# Altium schematic sheet STeaMi-FP12-Capteur_interne.SchDoc
size A3; DocumentNumber: 1; SheetNumber: 13; SheetTotal: 16
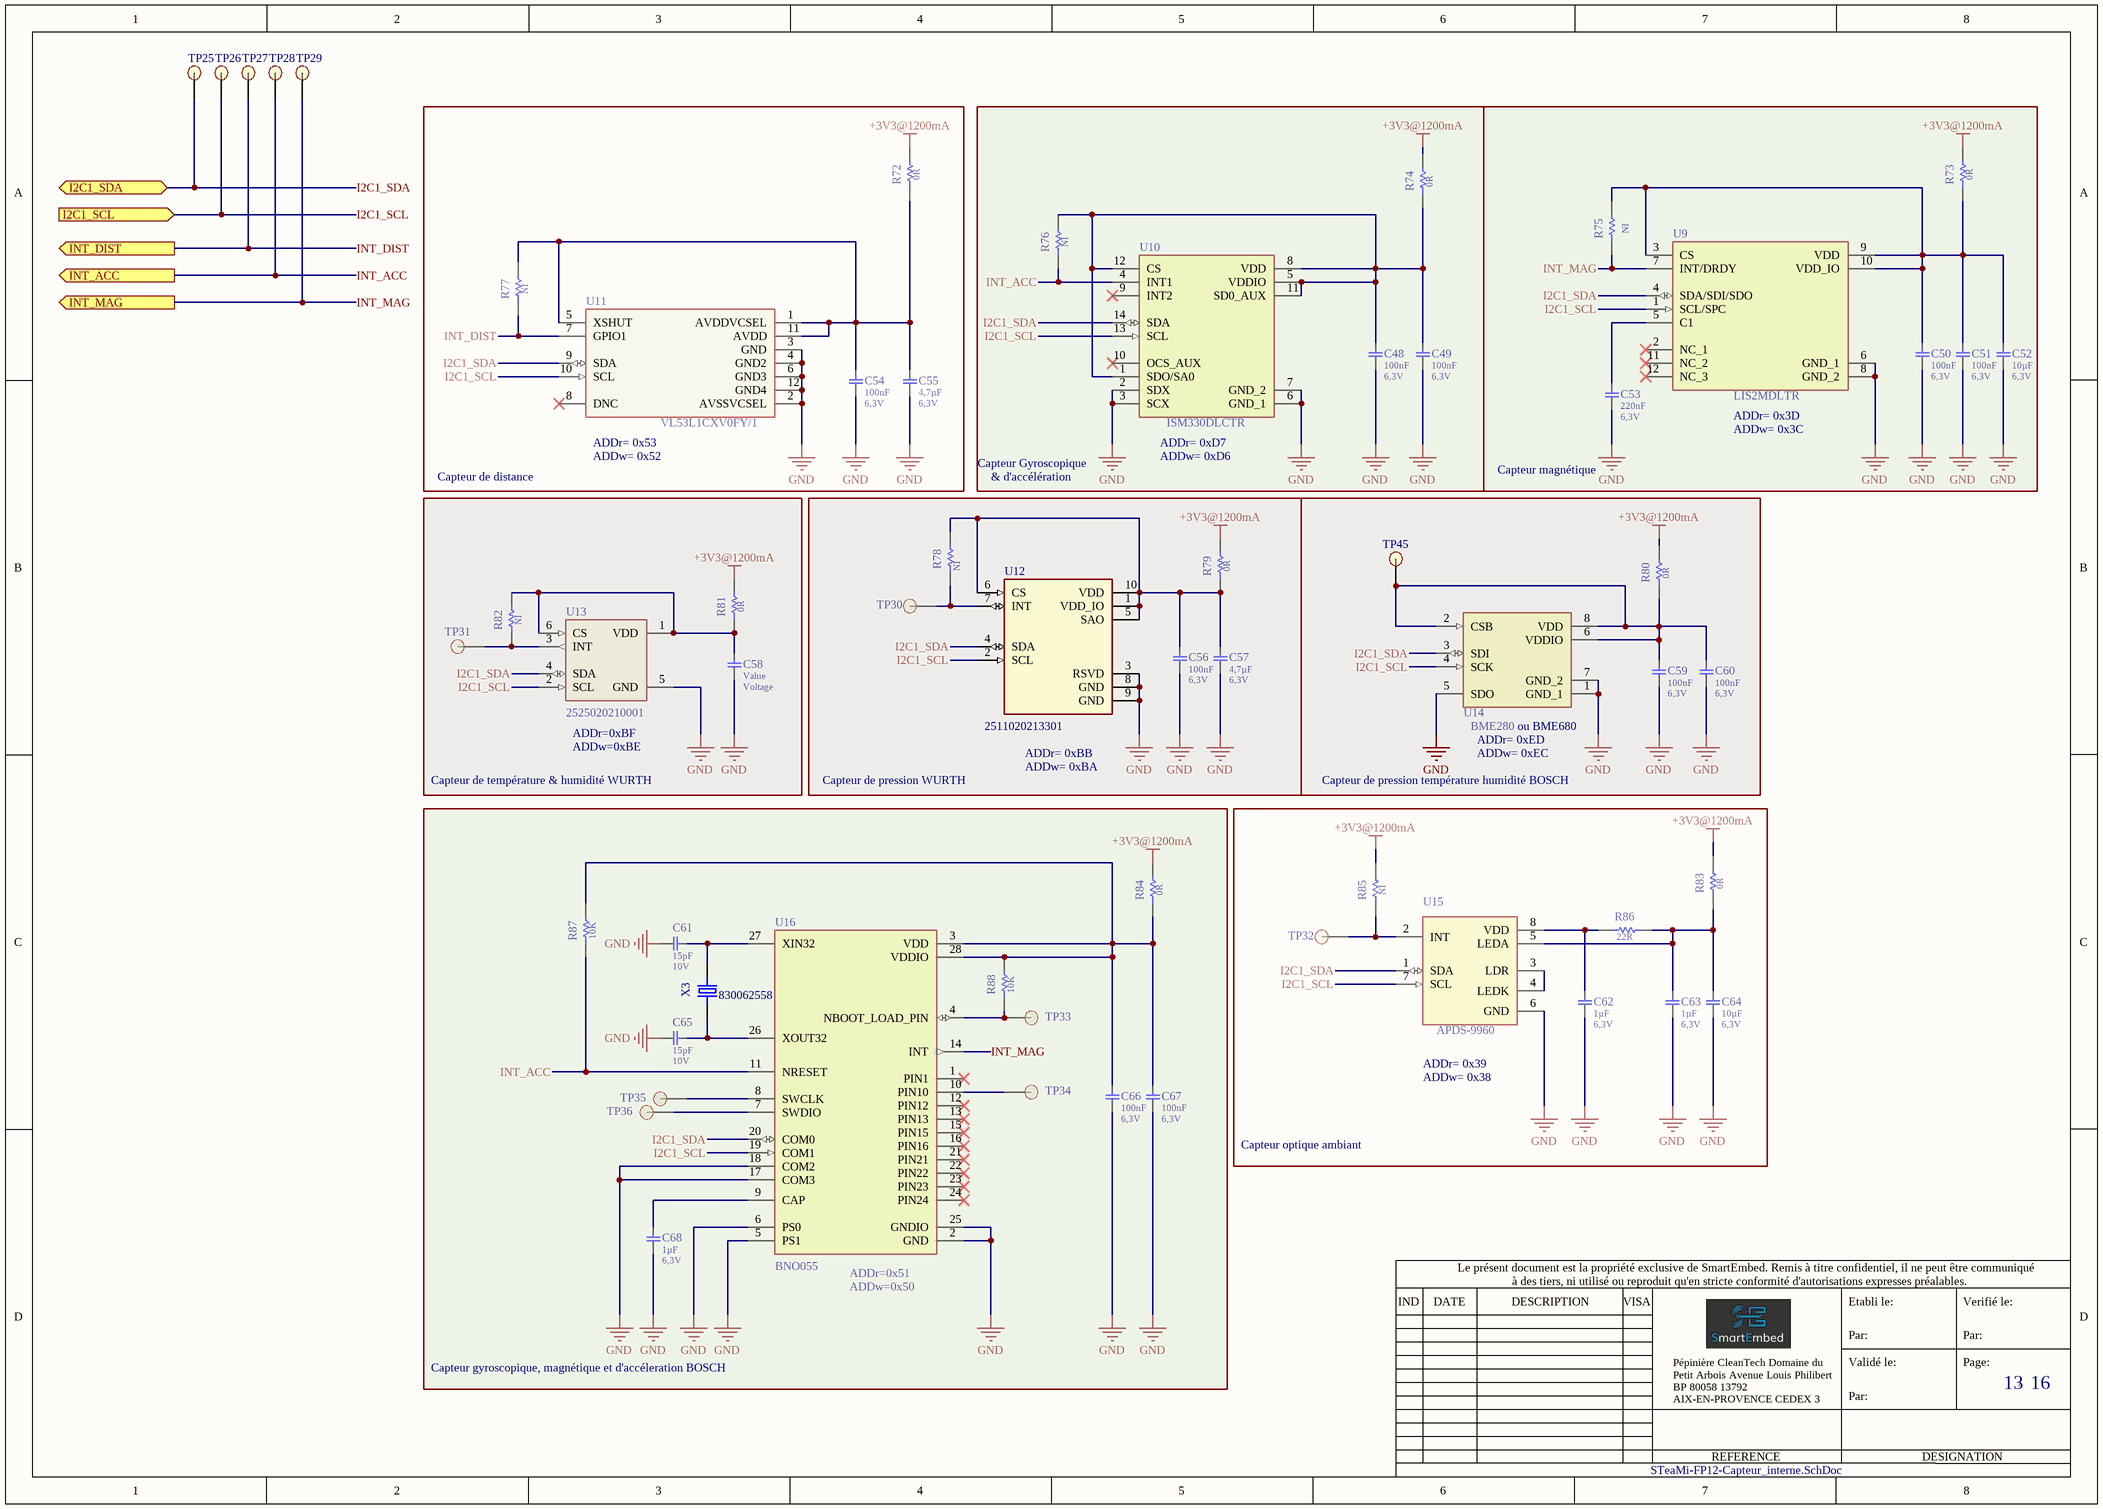
[diagram p0: STeaMi-FP12-Capteur_interne.SchDoc]

## Parts
C48  Capacitance: 100nF  Voltage: 6,3V  [0402-CAP]
C49  Capacitance: 100nF  Voltage: 6,3V  [0402-CAP]
C50  Capacitance: 100nF  Voltage: 6,3V  [0402-CAP]
C51  Capacitance: 100nF  Voltage: 6,3V  [0402-CAP]
C52  Capacitance: 10µF  Voltage: 6,3V  [0402-CAP]
C53  Capacitance: 220nF  Voltage: 6,3V  [0603-CAP-Small]
C54  Capacitance: 100nF  Voltage: 6,3V  [0402-CAP]
C55  Capacitance: 4,7µF  Voltage: 6,3V  [0402-CAP]
C56  Capacitance: 100nF  Voltage: 6,3V  [0402-CAP]
C57  Capacitance: 4,7µF  Voltage: 6,3V  [0402-CAP]
C58  Capacitance: Value  [0402-CAP]
C59  Capacitance: 100nF  Voltage: 6,3V  [0402-CAP]
C60  Capacitance: 100nF  Voltage: 6,3V  [0402-CAP]
C61  Capacitance: 15pF  Voltage: 10V  [0402-CAP]
C62  Capacitance: 1µF  Voltage: 6,3V  [0402-CAP]
C63  Capacitance: 1µF  Voltage: 6,3V  [0402-CAP]
C64  Capacitance: 10µF  Voltage: 6,3V  [0402-CAP]
C65  Capacitance: 15pF  Voltage: 10V  [0402-CAP]
C66  Capacitance: 100nF  Voltage: 6,3V  [0402-CAP]
C67  Capacitance: 100nF  Voltage: 6,3V  [0402-CAP]
C68  Capacitance: 1µF  Voltage: 6,3V  [0402-CAP]
R72  Resistance: 0R  [RESC1005X40N_0402]
R73  Resistance: 0R  [RESC1005X40N_0402]
R74  Resistance: 0R  [RESC1005X40N_0402]
R75  (no value)  [RESC1005X40N_0402]
R76  (no value)  [RESC1005X40N_0402]
R77  (no value)  [RESC1005X40N_0402]
R78  (no value)  [RESC1005X40N_0402]
R79  Resistance: 0R  [RESC1005X40N_0402]
R80  Resistance: 0R  [RESC1005X40N_0402]
R81  Resistance: 0R  [RESC1608X45N_0603]
R82  (no value)  [RESC1608X45N_0603]
R83  Resistance: 0R  [RESC1005X40N_0402]
R84  Resistance: 0R  [RESC1005X40N_0402]
R85  (no value)  [RESC1005X40N_0402]
R86  Resistance: 22R  [RESC1005X40N_0402]
R87  Resistance: 10K  [RESC1005X40N_0402]
R88  Resistance: 10K  [RESC1005X40N_0402]
TP25  SDA1  [Testpoint 1mm]  (value not drawn)  (no BOM)
TP26  SCL1  [Testpoint 1mm]  (value not drawn)  (no BOM)
TP27  INTD  [Testpoint 1mm]  (value not drawn)  (no BOM)
TP28  INTA  [Testpoint 1mm]  (value not drawn)  (no BOM)
TP29  INTM  [Testpoint 1mm]  (value not drawn)  (no BOM)
TP30  PAD  [Testpoint 1mm]  (value not drawn)  (no BOM)
TP31  PAD  [Testpoint 1mm]  (value not drawn)  (no BOM)
TP32  PAD  [Testpoint 1mm]  (value not drawn)  (no BOM)
TP33  PAD  [Testpoint 1mm]  (value not drawn)  (no BOM)
TP34  PAD  [Testpoint 1mm]  (value not drawn)  (no BOM)
TP35  PAD  [Testpoint 1mm]  (value not drawn)  (no BOM)
TP36  PAD  [Testpoint 1mm]  (value not drawn)  (no BOM)
TP45  PAD  [Testpoint 1mm]  (value not drawn)  (no BOM)
U9  (no value)  [LGA-12-2x2MM]
U10  (no value)  [LGA-14-2.5X3MM]
U11  Manufacturer Part Number: VL53L1CXV0FY/1  [VL53L1X]
U12  (no value)  [2511020213301]
U13  (no value)  [2525020210001]
U14  (no value)  [BME280]
U15  (no value)  [APDS-9960]
U16  (no value)  [LGA28R50P4X10_380X520X100]
X3  Part Number: 830062558  [WE_XTAL_IQXC-25]

## Ports
I2C1_SCL (in), I2C1_SDA (bidir), INT_ACC (out), INT_DIST (out), INT_MAG (out)

## Nets
+3V3@1200mA: R72.2 R73.2 R74.2 R79.2 R80.2 R81.2 R83.2 R84.2 R85.2
GND: C48.1 C49.1 C50.1 C51.1 C52.1 C53.1 C54.1 C55.1 C56.1 C57.1 C58.1 C59.1 C60.1 C61.1 C62.1 C63.1 C64.1 C65.1 C66.1 C67.1 C68.1 U9.6(GND_1) U9.8(GND_2) U10.2(SDX) U10.3(SCX) U10.6(GND_1) U10.7(GND_2) U11.2(AVSSVCSEL) U11.3(GND) U11.4(GND2) U11.6(GND3) U11.12(GND4) U12.3(RSVD) U12.8(GND) U12.9(GND) U13.5(GND) U14.1(GND_1) U14.5(SDO) U14.7(GND_2) U15.6(GND) U16.2(GND) U16.5(PS1) U16.6(PS0) U16.17(COM3) U16.18(COM2) U16.25(GNDIO)
I2C1_SCL: TP26.1 U9.1(SCL/SPC) U10.13(SCL) U11.10(SCL) U12.2(SCL) U13.2(SCL) U14.4(SCK) U15.7(SCL) U16.19(COM1) ; port I2C1_SCL
I2C1_SDA: TP25.1 U9.4(SDA/SDI/SDO) U10.14(SDA) U11.9(SDA) U12.4(SDA) U13.4(SDA) U14.3(SDI) U15.1(SDA) U16.20(COM0) ; port I2C1_SDA
INT_ACC: R76.1 R87.1 TP28.1 U10.4(INT1) U16.11(NRESET) ; port INT_ACC
INT_DIST: R77.1 TP27.1 U11.7(GPIO1) ; port INT_DIST
INT_MAG: R75.1 TP29.1 U9.7(INT/DRDY) U16.14(INT) ; port INT_MAG
NetC48_2: C48.2 C49.2 R74.1 R76.2 U10.1(SDO/SA0) U10.5(VDDIO) U10.8(VDD) U10.11(SD0_AUX) U10.12(CS)
NetC50_2: C50.2 C51.2 C52.2 R73.1 R75.2 U9.3(CS) U9.9(VDD) U9.10(VDD_IO)
NetC53_2: C53.2 U9.5(C1)
NetC54_2: C54.2 C55.2 R72.1 R77.2 U11.1(AVDDVCSEL) U11.5(XSHUT) U11.11(AVDD)
NetC56_2: C56.2 C57.2 R78.2 R79.1 U12.1(VDD_IO) U12.5(SAO) U12.6(CS) U12.10(VDD)
NetC58_2: C58.2 R81.1 R82.2 U13.1(VDD) U13.6(CS)
NetC59_2: C59.2 C60.2 R80.1 TP45.1 U14.2(CSB) U14.6(VDDIO) U14.8(VDD)
NetC61_2: C61.2 U16.27(XIN32) X3.2
NetC62_2: C62.2 R86.1 U15.8(VDD)
NetC63_2: C63.2 C64.2 R83.1 R86.2 U15.5(LEDA)
NetC65_2: C65.2 U16.26(XOUT32) X3.1
NetC66_2: C66.2 C67.2 R84.1 R87.2 R88.2 U16.3(VDD) U16.28(VDDIO)
NetC68_2: C68.2 U16.9(CAP)
NetR78_1: R78.1 TP30.1 U12.7(INT)
NetR82_1: R82.1 TP31.1 U13.3(INT)
NetR85_1: R85.1 TP32.1 U15.2(INT)
NetR88_1: R88.1 TP33.1 U16.4(NBOOT_LOAD_PIN)
NetTP34_1: TP34.1 U16.10(PIN10)
NetTP35_1: TP35.1 U16.8(SWCLK)
NetTP36_1: TP36.1 U16.7(SWDIO)
NetU15_3: U15.3(LDR) U15.4(LEDK)

Not connected (* = marked no-connect by the designer): U9 2(NC_1)* 11(NC_2)* 12(NC_3)*; U10 9(INT2)* 10(OCS_AUX)*; U11 8(DNC)*; U16 1(PIN1)* 12(PIN12)* 13(PIN13)* 15(PIN15)* 16(PIN16)* 21(PIN21)* 22(PIN22)* 23(PIN23)* 24(PIN24)*

## Notes on the sheet
- (near U11) ADDr= 0x53
- (near U10) ADDr= 0xD7
- (near U9) ADDr= 0x3D
- (near U9) ADDw= 0x3C
- Capteur de distance
- (near U11) ADDw= 0x52
- Capteur Gyroscopique
- & d'accélération
- (near U10) ADDw= 0xD6
- Capteur magnétique
- Capteur de température & humidité WURTH
- (near U13) ADDr=0xBF
- ADDw=0xBE
- Capteur de pression WURTH
- (near U12) ADDr= 0xBB
- ADDw= 0xBA
- Capteur de pression température humidité BOSCH
- (near U14) ADDr= 0xED
- ADDw= 0xEC
- (near U14) ou BME680
- (near U15) ADDr= 0x39
- ADDw= 0x38
- Capteur optique ambiant
- (near U16) ADDw=0x50
- (near U16) ADDr=0x51
- Capteur gyroscopique, magnétique et d'accéleration BOSCH
- Le présent document est la propriété exclusive de SmartEmbed. Remis à titre confidentiel, il ne peut être communiqué
- IND
- DATE
- DESCRIPTION
- VISA
- à des tiers, ni utilisé ou reproduit qu'en stricte conformité d'autorisations expresses préalables.
- Etabli le:
- Verifié le:
- Validé le:
- Par:
- Page:
- /
- Pépinière CleanTech Domaine du Petit Arbois Avenue Louis Philibert BP 80058 13792 AIX-EN-PROVENCE CEDEX 3
- REFERENCE
- DESIGNATION

## Library data of the parts
C48-C51 C54 C56 C59 C60 C66 C67 = 100nF-10%-6,3V-X5R-0402: CAP CER 100nF 6,3V X5R 0402; Manufacturer: Kyocera AVX; Manufacturer Part Number: 0402YD104KAT2A; Populated: True; std Package: 0402; Tolerence: 0,1; Vérification: Non; Created by: EAG; Creation Date: 18/10/2021; Checked by: *; Part Number: 100nF-10%-6,3V-X5R-0402; Dielectric: X5R; Digikey: 478-1126-1-ND; Mouser: 581-0402YD104K; Switch possibility: True
C52 C64 = 10µF-20%-6,3V-X5R-0402: CAP CER 10µF 6,3V X5R 0402; Manufacturer: Murata; Manufacturer Part Number: GRM155R60J106ME15D; Populated: True; std Package: 0402; Tolerence: 0,2; Vérification: Non; Created by: EAG; Creation Date: 01/04/2021; Checked by: *; Part Number: 10µF-20%-6,3V-X5R-0402; Dielectric: X5R; Digikey: 490-13238-1-ND; Farnell: -; Mouser: 81-GRM155R60J106ME5D; RS: -; Switch possibility: True
C53 = 220nF-10%-6,3V-X7R-0603: CAP CER 220nF 6,3V X7R 0603; Manufacturer 1: KEMET; Manufacturer Part Number 1: C0603C224K9RACTU; Populated: True; std Package: 0603; Tolerence: 0,1; Vérification: Non; Created by: EAG; Creation Date: 28/09/2021; Manufacturer: ="Manufacturer"; Manufacturer Part Number: ="Manufacturer Part Number"; Checked by: *; Part Number: 220nF-10%-6,3V-X7R-0603; Dielectric: X7R; Digikey: 399-9046-1-ND; Mouser: 80-C0603C224K9R; Switch possibility: True
C55 = 4,7µF-20%-6,3V-X5R-0402: CAP CER 4,7µF 6,3V X5R 0402; Populated: True; Created by: EAG; Creation Date: 01/04/2021; Checked by: *; Part Number: 4,7µF-20%-6,3V-X5R-0402
C57 = 4,7µF-20%-6,3V-X5R-0402: CAP CER 4,7µF 6,3V X5R 0402; Populated: True; std Package: 0402; Tolerence: 0,2; Vérification: Non; Created by: EAG; Creation Date: 01/04/2021; Checked by: *; Part Number: 4,7µF-20%-6,3V-X5R-0402; Dielectric: X5R; Digikey: 490-5408-6-ND; Mouser: 81-GRM155R60J475ME8D; Switch possibility: True
C58 = 100nF-10%-6,3V-X5R-0402: CAP CER 100nF 6,3V X5R 0402; Populated: True; Created by: *; Creation Date: *; Manufacturer: ="Manufacturer"; Manufacturer Part Number: ="Manufacturer Part Number"; Checked by: *; Voltage: Voltage; Part Number: 100nF-10%-6,3V-X5R-0402
C61 C65 = 15pF-5%-10V-C0G-0402: CAP CER 15pF 10V C0G 0402; Manufacturer: KEMET; Manufacturer Part Number: C0402C150J8HACTU; Populated: True; std Package: 0402; Tolerence: 0,05; Vérification: Non; Created by: EAG; Creation Date: 29/11/2021; Checked by: *; Part Number: 15pF-5%-10V-C0G-0402; Dielectric: C0G; Farnell: 3784148; Mouser: 80-C0402C150J8HACTU; Switch possibility: True
C62 C63 C68 = 1µF-10%-6,3V-X5R-0402: CAP CER 1µF 6,3V X5R 0402; Manufacturer: Taiyo Yuden; Manufacturer Part Number: JMK105BJ105KV-F; Populated: True; std Package: 0402; Tolerence: 0,1; Vérification: Non; Created by: EAG; Creation Date: 08/04/2021; Checked by: *; Part Number: 1µF-10%-6,3V-X5R-0402; Dielectric: X5R; Mouser: 963-JMK105BJ105KV-F; Switch possibility: True
R72-R74 R79 R80 R83 R84 = 0R-5%-0,0625W-0402: RES CMS 0R5%-0,0625W-0402; Manufacturer: Yageo; Manufacturer Part Number: RC0402JR-100RL; Populated: True; Power: 0,0625; Nom vérificateur: Non; Prix: 0,09; std Package: 0402; Tolerence: 0,05; Created by: EAG; Creation Date: 02/12/2021; Part Number: 0R-5%-0,0625W-0402; Mouser: 603-RC0402JR-100RL; Switch possibility: True
R75-R78 R82 R85 = NI-1%-0,1W-0603: NI; Populated: True; Power: 0,1; Nom vérificateur: Non; std Package: 0603; Tolerence: 1%; Created by: MSA; Creation Date: 20/03/2019; Manufacturer: -; Manufacturer Part Number: -; Resistance: NI; Part Number: NI-1%-0,1W-0603; Digikey: -; Farnell: -; Mouser: -; RS: -; Switch possibility: True
R81 = 0R-1%-0,1W-0603: RES CMS 0R 1% 0,1W 0603 ±100ppm/°C; Manufacturer: Vishay; Manufacturer Part Number: CRCW06030000Z0EAC; Populated: True; Power: 0,1; Nom vérificateur: Non; std Package: 0603; Tolerence: 0,01; Created by: MSA; Creation Date: 20/03/2019; Part Number: 0R-1%-0,1W-0603; Digikey: 541-4012-1-ND; Farnell: -; Mouser: 71-CRCW06030000Z0EAC; RS: -; Switch possibility: True
R86 = 22R-0,5%-0,0625W-0402: RES CMS 22R0,5%-0,0625W-0402 ±100ppm/°C; Manufacturer: Panasonic; Manufacturer Part Number: ERJ2RKD22R0X; Populated: True; Power: 0,0625; Nom vérificateur: Non; Prix: 0,105; std Package: 0402; Tolerence: 0,005; Created by: EAG; Creation Date: 02/12/2021; Part Number: 22R-0,5%-0,0625W-0402; Mouser: 667-ERJ-2RKD22R0X; Switch possibility: True
R87 R88 = 10K-1%-0,0625W-0402: RES CMS 10K1%-0,0625W-0402 ±100ppm/°C; Manufacturer: Yageo; Manufacturer Part Number: AC0402FR-1310KL; Populated: True; Power: 0,0625; Nom vérificateur: Non; Prix: 0,088; std Package: 0402; Tolerence: 0,01; Created by: EAG; Creation Date: 08/06/2021; Part Number: 10K-1%-0,0625W-0402; Mouser: 603-AC0402FR-1310KL; Switch possibility: True
TP25-TP36 = TESTPOINTPAD: Manufacturer: Smartembed; Switch possibility: False; Vérification: Non; Package: PAD_TEST; Part Number: TESTPOINTPAD; Created by: EAG; Creation Date: 11/03/2020; Digikey: -; Farnell: -; Manufacturer Part Number: TESTPOINT; Mouser: -; RS: -
TP45 = TESTPOINTPAD: Manufacturer: SmartEmbed; Package: PAD_TEST; Part Number: TESTPOINTPAD
U9 = LIS2MDLTR: magnétorésistif Capteur X, Y, Z axe 12-LGA (2x2); Manufacturer: STMicroelectronics; Populated: False; Switch possibility: False; Vérification: Non; Created by: EAG; Creation Date: 28/09/2021; Checked by: *; Ambient Temperature: ='Ambient temp'; Storage temperature: ='Storage temp'; Current: *; RoHs compliant: ='Rohs'; Datasheet: ='Datasheet'; Manufacturer Part Number: LIS2MDLTR; Part Number: LIS2MDLTR; Digikey: 497-17588-2-ND
U10 = ISM330DLCTR: Accéléromètre, gyroscope, température, 6 axes Anturi I²C, SPI Sortie; Manufacturer: STMicroelectronics; Populated: False; Switch possibility: False; Vérification: Non; Created by: EAG; Creation Date: 28/09/2021; Checked by: *; Ambient Temperature: ='Ambient temp'; Storage temperature: ='Storage temp'; Current: *; RoHs compliant: ='Rohs'; Datasheet: ='Datasheet'; Manufacturer Part Number: ISM330DLCTR; Part Number: ISM330DLCTR; Digikey: 497-17583-2-ND
U11 = VL53L1X: SENSOR OPTICAL 4M I2C; Manufacturer: STMicroelectronics; Populated: False; Switch possibility: False; Vérification: Non; Created by: EAG; Creation Date: 28/09/2021; Checked by: *; Ambient Temperature: ='Ambient temp'; Storage temperature: ='Storage temp'; Current: *; RoHs compliant: ='Rohs'; Datasheet: ='Datasheet'; Part Number: VL53L1X; Digikey: 497-17764-1-ND; Mouser: 511-VL53L1CXV0FY/1
U12 = 2511020213301: Capteur de pression 3,77PSI ~ 18,27PSI (26kPa ~ 126kPa) Absolu  24 b 10-WFLGA; Manufacturer: Wurth Elektronik; Populated: False; Switch possibility: False; Vérification: Non; Created by: EAG; Creation Date: 28/09/2021; Checked by: *; Ambient Temperature: ='Ambient temp'; Storage temperature: ='Storage temp'; Current: *; RoHs compliant: ='Rohs'; Datasheet: ='Datasheet'; Manufacturer Part Number: 2511020213301; Part Number: 2511020213301; Digikey: 1917-2511020213301CT-ND
U13 = 2525020210001: Humidité, température Capteur I²C, SPI Sortie; Manufacturer: Wurth Elektronik; Populated: False; Switch possibility: False; Vérification: Non; Created by: EAG; Creation Date: 28/09/2021; Checked by: *; Ambient Temperature: ='Ambient temp'; Storage temperature: ='Storage temp'; Current: *; RoHs compliant: ='Rohs'; Datasheet: ='Datasheet'; Manufacturer Part Number: 2525020210001; Part Number: 2525020210001; Digikey: 1917-2525020210001CT-ND
U14 = BME280: Capteur de température et d'humidité 0 ~ 100 %HR I²C, SPI ±3% 1s Montage en surface; Manufacturer: Bosch; Populated: False; Switch possibility: False; Vérification: Non; Created by: EAG; Creation Date: 28/09/2021; Checked by: *; Ambient Temperature: ='Ambient temp'; Storage temperature: ='Storage temp'; Current: *; RoHs compliant: ='Rohs'; Datasheet: ='Datasheet'; Manufacturer Part Number: BME280; Part Number: BME280; Digikey: 828-1063-6-ND; Mouser: 262-BME280
U15 = APDS-9960: Capteurs optiques Ambiant 560nm I²C Module 8-SMD; Manufacturer: Broadcom Limited; Populated: False; Switch possibility: False; Vérification: Non; Created by: EAG; Creation Date: 29/09/2021; Checked by: *; Ambient Temperature: ='Ambient temp'; Storage temperature: ='Storage temp'; Current: *; RoHs compliant: ='Rohs'; Datasheet: ='Datasheet'; Manufacturer Part Number: APDS-9960; Part Number: APDS-9960; Digikey: 516-3480-1-ND; Mouser: 630-APDS-9960
U16 = BNO055: Accéléromètre, gyroscope, magnétomètre, 9 axes Anturi I²C, UART Sortie; Manufacturer: Bosch; Populated: False; Switch possibility: False; Vérification: Non; Created by: EAG; Creation Date: 28/09/2021; Checked by: *; Ambient Temperature: ='Ambient temp'; Storage temperature: ='Storage temp'; Current: *; RoHs compliant: ='Rohs'; Datasheet: ='Datasheet'; Manufacturer Part Number: BNO055; Part Number: BNO055; Digikey: 828-1058-1-ND
X3 = 830062558: QUARTZ 32Khz 12pF 30 ppm; Manufacturer: Wurth; Populated: True; Frequency: 32,768KHz; Switch possibility: False; Vérification: Non; Created by: EAG; Creation Date: 30/09/2021; Manufacturer Part Number: 830062558; Digikey: 732-830062558CT-ND; Mouser: 710-830062558